# Altium schematic sheet LM2596.SchDoc
size A4; SheetNumber: 2; SheetTotal: 10
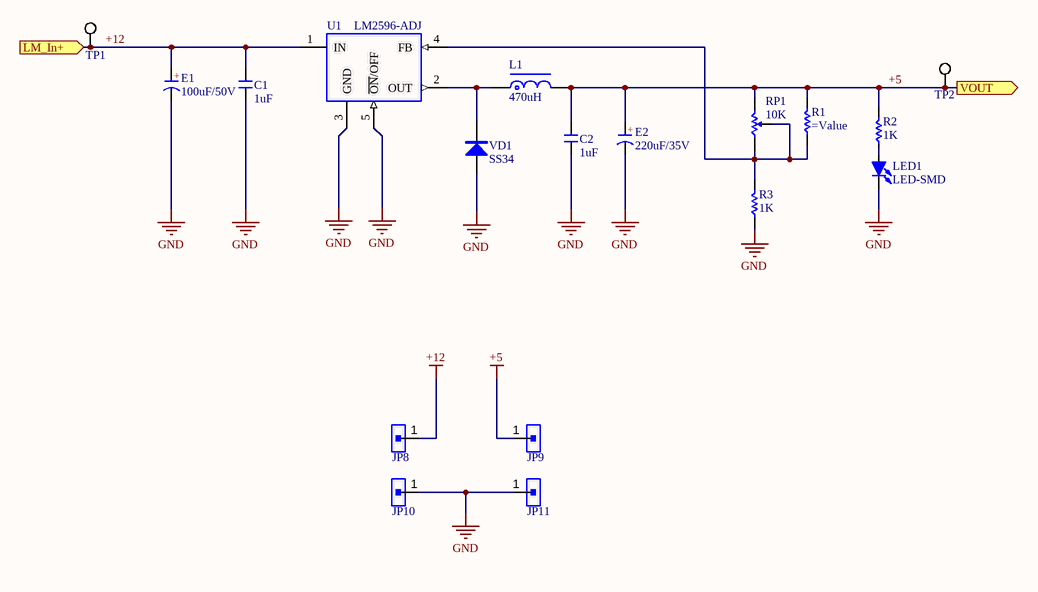
[diagram p0: LM2596.SchDoc]

## Parts
C1  1uF  [C 0805]
C2  1uF  [C 0805]
E1  100uF/50V  [CM E(8*10.2)]
E2  220uF/35V  [CM E(8*10.2)]
JP8  HDR-1X1  [HDR-1X1]  (value not drawn)
JP9  HDR-1X1  [HDR-1X1]  (value not drawn)
JP10  HDR-1X1  [HDR-1X1]  (value not drawn)
JP11  HDR-1X1  [HDR-1X1]  (value not drawn)
L1  470uH  [CDRH127]
LED1  LED-SMD  [LED 0805R]
R1  (no value)  [R 0805]
R2  1K  [R 0805]
R3  1K  [R 0805]
RP1  10K  [3296W]
TP1  Test Point Pad  [TP15]  (value not drawn)
TP2  Test Point Pad  [TP15]  (value not drawn)
U1  LM2596-ADJ  [TO263-5A]
VD1  SS34  [SMA]

## Ports
LM_In+ (in), VOUT (out)

## Nets
+5: C2.2 E2.1(A) JP9.1 L1.2 R1.2 R2.2 RP1.2 TP2.1 ; port VOUT
+12: C1.2 E1.1(A) JP8.1 TP1.1 U1.1(IN) ; port LM_In+
GND: C1.1 C2.1 E1.2(K) E2.2(K) JP10.1 JP11.1 LED1.2(K) R3.1 U1.3(GND) U1.5(~{ON}/OFF) VD1.1(A)
NetL1_1: L1.1 U1.2(OUT) VD1.2(K)
NetLED1_1: LED1.1(A) R2.1
NetR1_1: R1.1 R3.2 RP1.1 RP1.ADJ U1.4(FB)

## Notes on the sheet
- (in symbol C-CM) +

## Library data of the parts
C1 C2 = C: Non-polar patch capacitor; BOM名称: 无极性贴片电容; 版权归属: 源创客; 学习资源: www.ooocke.com
E1 E2 = C-CM: Chip electrolytic capacitor; BOM名称: 贴片电解电容; 版权归属: 源创客; 学习资源: www.ooocke.com
JP8-JP11 = Header 1: 1P Connector; BOM名称: 1P接插件; 版权归属: 源创客; 学习资源: www.ooocke.com
L1 = L-CDRH: Power shielded inductor; BOM名称: 功率屏蔽电感; 版权归属: 源创客; 学习资源: www.ooocke.com
LED1 = LED-SMD: Patch LED; BOM名称: 贴片LED; 版权归属: 源创客; 学习资源: www.ooocke.com
R1-R3 = R: Chip resistor; 版权归属: 源创客; BOM名称: Chip resistor; 学习资源: www.ooocke.com
RP1 = RP-THD: Plug-in potentiometer; BOM名称: 插件电位器; 版权归属: 源创客; 学习资源: www.ooocke.com
TP1 TP2 = Test Point Pad: Company: SJ Libraries; Designer: Eng. Saeid Jorablo; Rule: UNIONINDEX=0|RULEKIND=ComponentClearance|NETSCOPE=AnyNet|LAYERKIND=SameLayer|NAME=Schematic Component Clearance Constraint|GAP=0mil|COLLISIONCHECKMODE=3|VERTICALGAP=0mil|SHOWDISTANCES=FALSE|UNIT=Imperial; Mounting Technology: Surface Mount\Through-Hole; ComponentLink1Description: Datasheet; Pin Count: 0; Update Date: 6/3/2012; Category: MISC; HelpURL: http://s3.picofile.com/file/7443264187/Coming_Soon_logo.gif
U1 = LM2596: DC step-down chip; BOM名称: DC稳压芯片; 版权归属: 源创客; 学习资源: www.ooocke.com
VD1 = SS34: Schottky diodes; BOM名称: 肖特基二极管; 版权归属: 源创客; 属性: 40V/3A; 学习资源: www.ooocke.com